# EAGLE design Filter Big 1.0 (EAGLE 7.2.0)
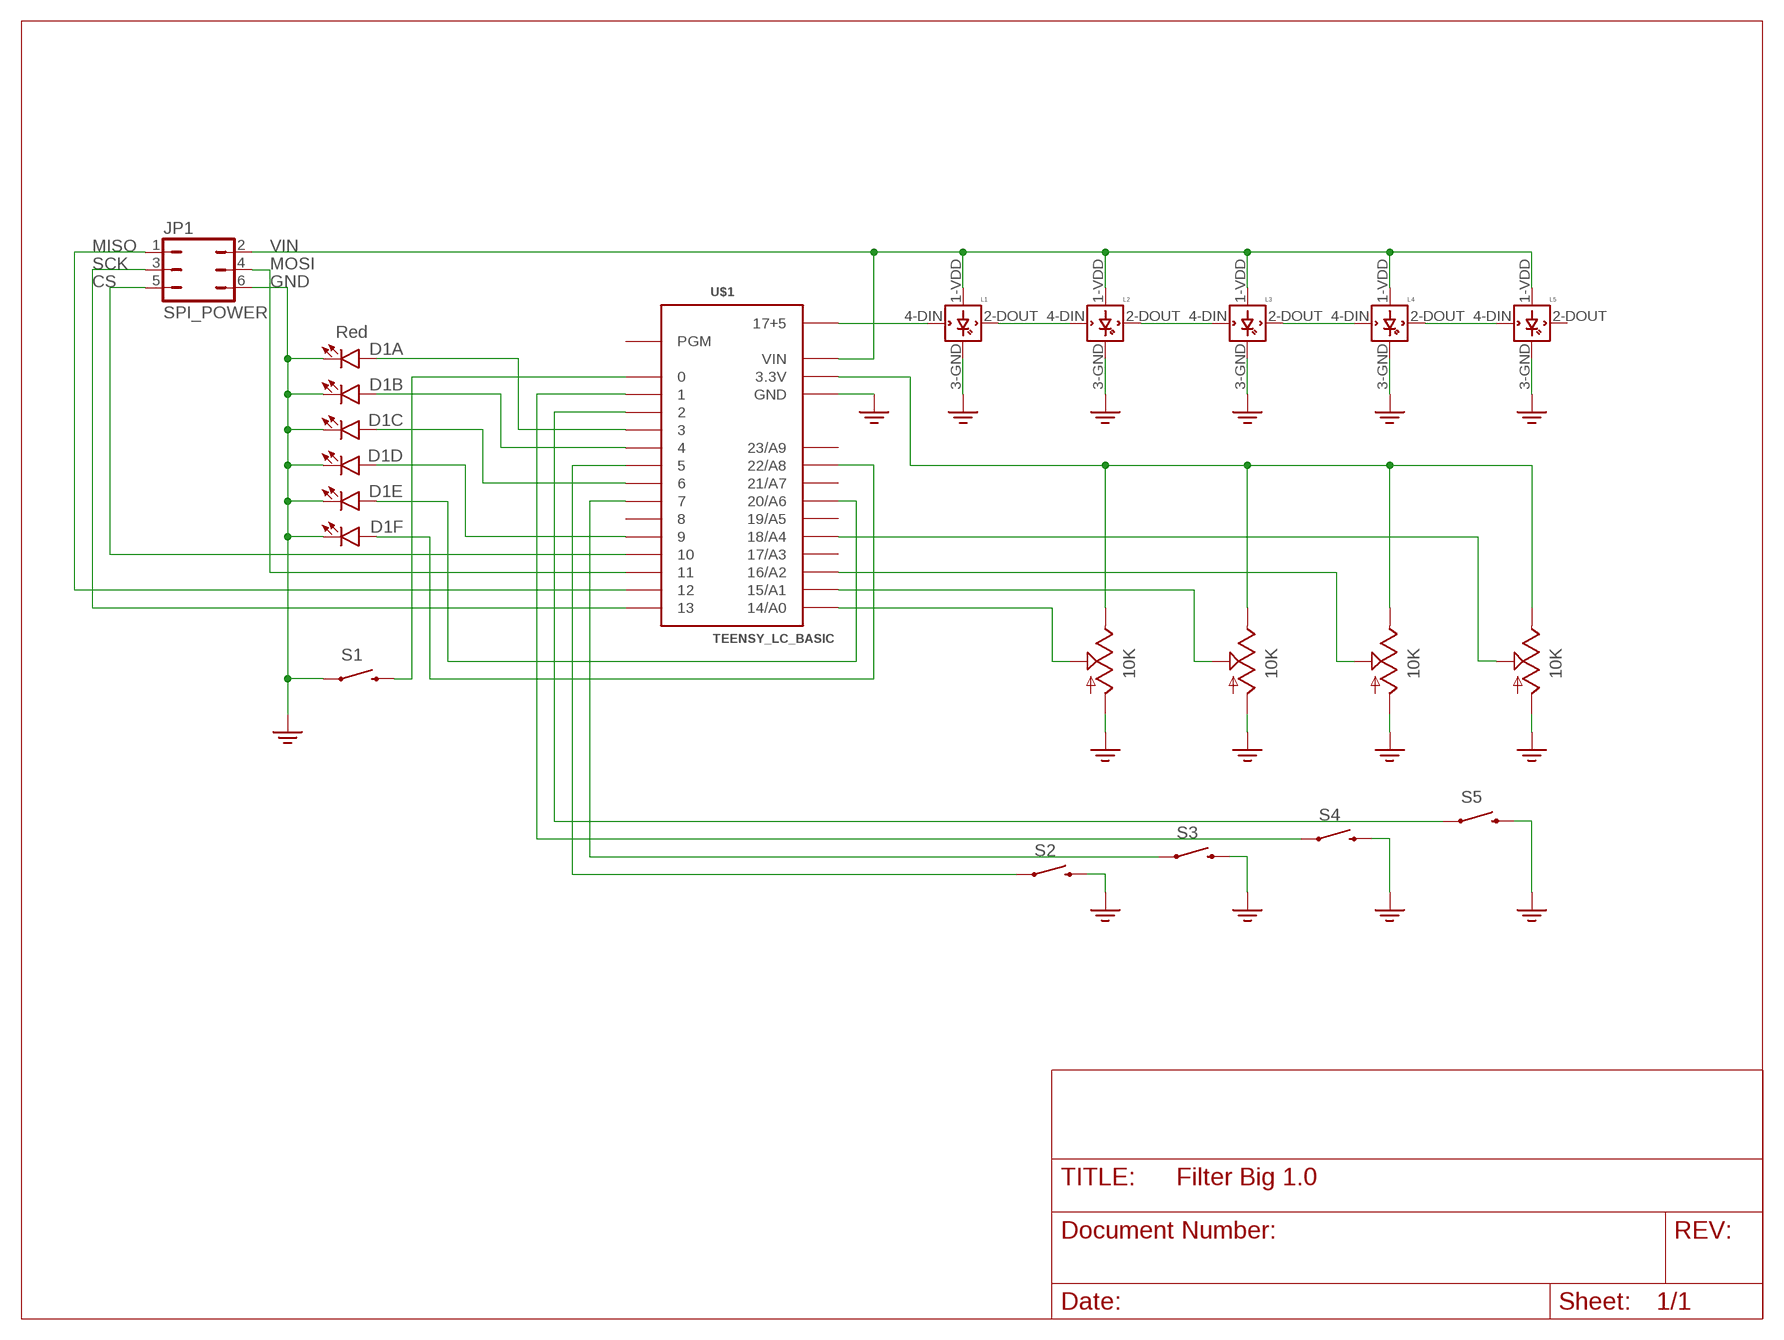
[diagram p0: schematic, sheet 1]

## Parts
D1  Red  LED_BARGRAPH_6  [LED_BARGRAPH_6]
JP1  SPI_POWER  JP3Q  [JP3Q]
L1  WS2812B  [WS2812B]
L2  WS2812B  [WS2812B]
L3  WS2812B  [WS2812B]
L4  WS2812B  [WS2812B]
L5  WS2812B  [WS2812B]
S1  SWITCH-MOMENTARY-212MM  [TACTILE-PTH-12MM]
S2  SWITCH-MOMENTARY-2SMD  [TACTILE-SWITCH-SMD]
S3  SWITCH-MOMENTARY-2SMD  [TACTILE-SWITCH-SMD]
S4  SWITCH-MOMENTARY-2SMD  [TACTILE-SWITCH-SMD]
S5  SWITCH-MOMENTARY-2SMD  [TACTILE-SWITCH-SMD]
U$1  TEENSY_LC_BASIC  [TEENSY_LC_BASIC]
U$2  10K  ALPHA1400F10K  [14MMPOT]
U$3  10K  ALPHA1400F10K  [14MMPOT]
U$4  10K  ALPHA1400F10K  [14MMPOT]
U$5  10K  ALPHA1400F10K  [14MMPOT]

## Nets
3.3V: U$1.3.3V1(3.3V) U$2.P$4(E) U$3.P$4(E) U$4.P$4(E) U$5.P$4(E)
GND: D1.7(F:C) D1.8(E:C) D1.9(D:C) D1.10(C:C) D1.11(B:C) D1.12(A:C) JP1.6 L1.3-GND(GND) L2.3-GND(GND) L3.3-GND(GND) L4.3-GND(GND) L5.3-GND(GND) S1.1 S2.3 S3.3 S4.3 S5.3 U$1.GND U$1.GND1(GND) U$1.GND2(GND) U$2.P$5(A) U$3.P$5(A) U$4.P$5(A) U$5.P$5(A) ; supply symbol labelled GND2
N$1: L1.4-DIN(DIN) U$1.17+5
N$2: L1.2-DOUT(DOUT) L2.4-DIN(DIN)
N$3: L2.2-DOUT(DOUT) L3.4-DIN(DIN)
N$4: L3.2-DOUT(DOUT) L4.4-DIN(DIN)
N$5: L4.2-DOUT(DOUT) L5.4-DIN(DIN)
N$7: U$1.14/A0 U$2.P$3(S)
N$8: U$1.15/A1 U$3.P$3(S)
N$9: U$1.16/A2 U$4.P$3(S)
N$10: U$1.18/A4 U$5.P$3(S)
N$12: S2.1 U$1.5
N$13: S3.1 U$1.7
N$14: S4.1 U$1.1
N$15: D1.1(A:A) U$1.3
N$16: D1.2(B:A) U$1.4
N$17: D1.3(C:A) U$1.6
N$18: D1.4(D:A) U$1.9
N$19: D1.5(E:A) U$1.20/A6
N$20: D1.6(F:A) U$1.22/A8
N$21: JP1.1 U$1.12
N$22: S1.3 U$1.0
N$23: JP1.3 U$1.13
N$24: JP1.5 U$1.10
N$25: S5.1 U$1.2
N$28: JP1.4 U$1.11
VIN: JP1.2 L1.1-VDD(VDD) L2.1-VDD(VDD) L3.1-VDD(VDD) L4.1-VDD(VDD) L5.1-VDD(VDD) U$1.VIN
Unconnected: L5.2-DOUT(DOUT) U$1.8 U$1.17/A3 U$1.19/A5 U$1.21/A7 U$1.23/A9 U$1.PGM

## Notes on the sheet
- MISO | VIN
- SCK | MOSI
- CS | GND

## Library data of the parts
D1 = SynthLib:LED_BARGRAPH_6: 10-Segment LED Bar Graph SFE part numbers: COM-09935 (red, Vf = 2.1V, Ifmax = 20mA) COM-09936 (yellow, Vf = 2.1V, Ifmax = 20mA) COM-09937 (blue, Vf = 3.4V, Ifmax = 20mA) COM-09938 (green, Vf = 3.4V, Ifmax = 20mA)
JP1 = jumper:JP3Q: JUMPER
L1-L5 = SynthLib:WS2812B
S1 = SynthLib:SWITCH-MOMENTARY-2: Various NO switches- pushbuttons, reed, etc; PROD_ID: SWCH-09185
S2-S5 = SynthLib:SWITCH-MOMENTARY-2: Various NO switches- pushbuttons, reed, etc; PROD_ID: SWCH-08247
U$1 = SynthLib:TEENSY_LC_BASIC: Basic Teensy LC with none of the 'inner' pins enabled. See '+4', 'AllAnalogPins", and 'AllPins' packages for additional pin holes, as needed.
U$2-U$5 = SynthLib:ALPHA1400F: Alpha 1400F series clear shaft potentiometer

## Board
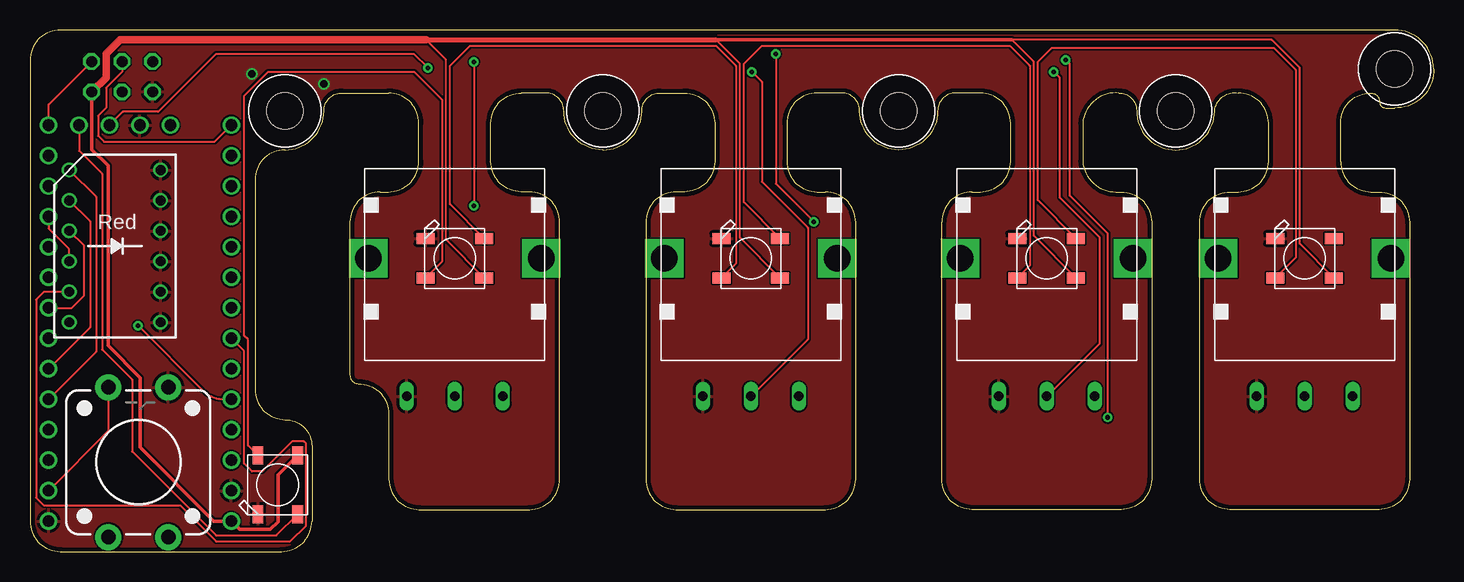
[diagram p1: board, top side]
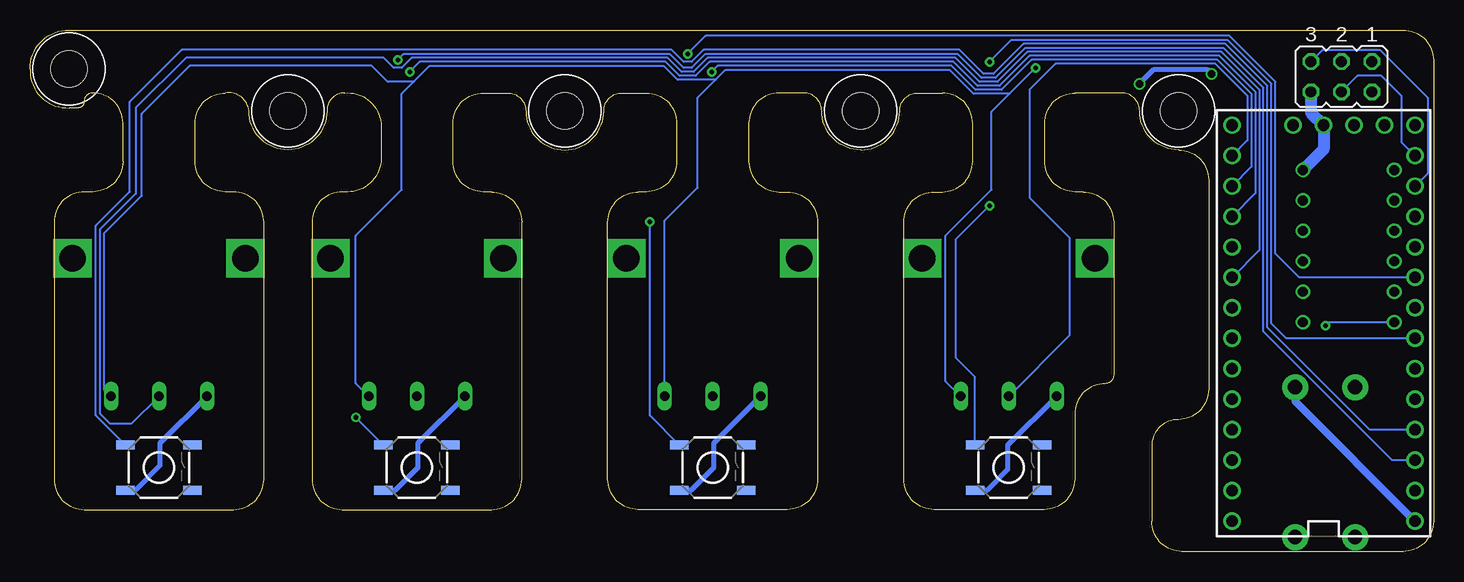
[diagram p2: board, bottom side, seen from below]

Size 117 x 43.5 mm. Coordinates in mm from the lower left corner, seen from the top.
Outline: 29.92,9.46 29.92,6.04 arc90 32.46,3.5 41.63,3.5 arc90 44.17,6.04 44.17,27.46 arc90 41.63,30
Outline: 78.54,30 arc90 76,27.46 76,6.04 arc90 78.54,3.5 90.96,3.5 arc90 93.5,6.04 93.5,27.46 arc90 90.96,30 90.79,30 arc-90 87.75,32.54 87.75,35.71 arc-90 90.79,38.25 arc-90 92.25,36.79 92.25,36.75 arc90 95.5,33.5 arc90 98.75,36.75 98.75,36.79 arc-90 100.71,38.25 arc-90 103.25,35.71 103.25,32.54 arc-90 100.71,30 100.04,30 arc90 97.5,27.46 97.5,6.04 arc90 100.04,3.5 112.46,3.5 arc90 115,6.04 115,27.46 arc90 112.46,30 111.79,30 arc-90 109.25,32.54 109.25,35.71
Outline: 109.25,35.75 arc-90 111.75,38.25 arc-90 112.5,37.5 arc90 113,37 113.75,37 arc90 117,40 117,40.25 arc90 113.75,43.5 2.54,43.5 arc90 0,40.96 0,2.54 arc90 2.54,0 20.96,0 arc90 23.5,2.54 23.5,8.79 arc90 21.29,11 arc-90 18.75,13.54 18.75,31 arc-90 21.25,33.5 arc90 24.5,36.75 arc-90 26,38.25 29.88,38.25 arc-90 32.42,35.71 32.42,32.54 arc-90 29.88,30 29.21,30 arc90 26.67,27.46 26.67,14.71 arc90 27.38,14 arc-90 29.92,11.46 29.92,9.5
Outline: 41.75,30 40.96,30 arc-90 38.42,32.54 38.42,35.71 arc-90 40.96,38.25 43,38.25 arc-90 44.5,36.75 arc90 47.75,33.5 arc90 51,36.75 arc-90 52.5,38.25 54.54,38.25 arc-90 57.08,35.71 57.08,32.54 arc-90 54.54,30 53.87,30 arc90 51.33,27.46 51.33,6.04 arc90 53.87,3.5 66.29,3.5 arc90 68.83,6.04 68.83,27.46 arc90 66.29,30 65.62,30 arc-90 63.08,32.54 63.08,35.71 arc-90 65.62,38.25 67.67,38.25 arc-90 69.17,36.75 arc90 72.42,33.5 arc90 75.67,36.75 arc-90 77.17,38.25 79.21,38.25 arc-90 81.75,35.71 81.75,32.54 arc-90 79.21,30 78.5,30
Copper layers (1*16): Top 0.0356mm / dielectric 1.5011mm / Bottom 0.0356mm
Design rules "LaenPCBOrder *": minimum track width 6mil, minimum drill 13mil, track to track 6mil, track to pad 6mil, pad to pad 6mil, via to via 6mil, smd to smd 6mil, copper to edge 15mil, drill to drill 6mil, minimum pad ring 7mil, minimum via ring 7mil, stop-mask expansion 3mil, vias tented up to drill 0mil, thermal gap 10mil

### Footprints (pad centres in the part's own frame; a part is rotated, then mirrored left to right if it is on the bottom)
LED_BARGRAPH_6 = drill 0.813: 1 -6.35,-3.81; 2 -3.81,-3.81; 3 -1.27,-3.81; 4 1.27,-3.81; 5 3.81,-3.81; 6 6.35,-3.81; 7 6.35,3.81; 8 3.81,3.81; 9 1.27,3.81; 10 -1.27,3.81; 11 -3.81,3.81; 12 -6.35,3.81
JP3Q = drill 0.914 octagon: 1 -2.54,-1.27; 2 -2.54,1.27; 3 0,-1.27; 4 0,1.27; 5 2.54,-1.27; 6 2.54,1.27
WS2812B = smd 1.5 x 0.9: 1-VDD 2.45,-1.65; 2-DOUT 2.45,1.65; 3-GND -2.45,1.65; 4-DIN -2.45,-1.65
TACTILE-PTH-12MM = drill 1.2 pad 2.159: 1 6.25,-2.5; 2 -6.25,-2.5; 3 6.25,2.5; 4 -6.25,2.5
TACTILE-SWITCH-SMD = smd 1.524 x 0.762: 1 -2.794,1.905; 2 2.794,1.905; 3 -2.794,-1.905; 4 2.794,-1.905
TEENSY_LC_BASIC = drill 0.965: 0 -7.62,13.97; 1 -7.62,11.43; 2 -7.62,8.89; 3 -7.62,6.35; 3.3V 7.62,11.43; 3.3V1 -2.54,-16.51; 4 -7.62,3.81; 5 -7.62,1.27; 6 -7.62,-1.27; 7 -7.62,-3.81; 8 -7.62,-6.35; 9 -7.62,-8.89; 10 -7.62,-11.43; 11 -7.62,-13.97; 12 -7.62,-16.51; 13 7.62,-16.51; 14/A0 7.62,-13.97; 15/A1 7.62,-11.43; 16/A2 7.62,-8.89; 17+5 -5.08,-16.51; 17/A3 7.62,-6.35; 18/A4 7.62,-3.81; 19/A5 7.62,-1.27; 20/A6 7.62,1.27; 21/A7 7.62,3.81; 22/A8 7.62,6.35; 23/A9 7.62,8.89; GND -7.62,16.51; GND1 0,-16.51; GND2 7.62,13.97; PGM 2.54,-16.51; VIN 7.62,16.51
14MMPOT = drill 2.2 square: P$1 -7.2,0; P$2 7.2,0 | drill 0.8 long: P$3 0,-11.5; P$4 4,-11.5; P$5 -4,-11.5
STANDOFF-M3 = hole 3: 0,0

### Placement (x,y rotation side)
D1  7.08,25.47 270 top
JP1  7.67,39.6 180 bottom
L1  20.65,5.56 90 top
L2  35.42,24.45 0 top
L3  60.08,24.45 0 top
L4  84.75,24.45 0 top
L5  106.25,24.45 0 top
S1  9.04,7.45 90 top
S2  35.42,7 0 bottom
S3  60.08,7 0 bottom
S4  84.75,7 0 bottom
S5  106.25,7 0 bottom
U$1  9.16,19.05 180 bottom
U$2  35.42,24.45 0 top
U$3  60.08,24.45 0 top
U$4  84.75,24.45 0 top
U$5  106.25,24.45 0 top
U$6  [STANDOFF-M3]  21.25,36.75 0 top
U$7  [STANDOFF-M3]  47.75,36.75 0 top
U$8  [STANDOFF-M3]  72.42,36.75 0 top
U$9  [STANDOFF-M3]  95.5,36.75 0 top
U$10  [STANDOFF-M3]  113.75,40.25 0 top

### Tracks (layer width: path | path; a pad name or v marks a point on that pad's centre or on a via)
3.3V  (via drill 0.4)
  Top 0.16: 14.33,40.33 10.67,36.67 7.73,36.67 U$1.3.3V1 | 14.33,40.33 | 14.33,40.33 15.5,41.5 32,41.5 v33.17,40.33
  Bottom 0.16: U$2.P$4 40.67,14.2 40.67,26.33 36.83,30.17 36.83,36.67 35.33,38.17 | U$4.P$4 89.83,14.03 89.83,26.33 86,30.17 86,38.17 85,39.17 | U$5.P$4 110.83,13.53 110.83,26.5 107.67,29.67 107.67,36.5 103.67,40.5 88.5,40.5 87.17,39.17 85,39.17 | U$3.P$4 64.08,27.58 61.33,30.33 61.33,37.83 59.83,39.33 | 59.83,39.33 59,40.17 40.33,40.17 38.33,38.17 35.33,38.17 | 59.83,39.33 63,39.33 64.17,40.5 83.67,40.5 85,39.17 | v33.17,40.33 | v33.17,40.33 35.33,38.17
GND  (via drill 0.6)
  Bottom 0.406: U$2.P$5 35.5,8.87 35.5,6.83 37.24,5.09 S2.3 | U$3.P$5 60,9.03 60,7 61.91,5.09 S3.3 | U$4.P$5 84.67,9.03 84.67,7 86.57,5.09 S4.3 | U$5.P$5 106.17,9.03 106.17,7.17 108.24,5.09 S5.3 | v18.5,39.83 18.83,40.17 23.33,40.17 v24.5,39
  Bottom 0.61: S1.1 11.54,12.53 U$1.GND
  Bottom 1.016: JP1.6 10.21,36.61 U$1.GND1 9.16,33.55 D1.12
  pour Top: 121.5,44.5 121.5,-1 -1,-1 -1,44.5
N$1
  Top 0.16: L1.4-DIN 20.52,1.33 15.5,1.33 8.5,8.33 8.5,14.33 6,16.83 6,31.5 4.08,33.42 U$1.17+5
N$2
  Top 0.16: L2.4-DIN 34.33,24.17 34.33,37.67 32,40 19.83,40 17.83,38 17.83,18 18.17,17.67 18.17,8.84 L1.2-DOUT
N$3
  Top 0.16: L2.2-DOUT 35,28.97 35,40.5 36.67,42.17 57.17,42.17 58.83,40.5 58.83,24 L3.4-DIN
N$4
  Top 0.16: L3.2-DOUT 59.5,29.13 59.5,40.67 61,42.17 81.67,42.17 83.33,40.5 83.33,23.83 L4.4-DIN
N$5
  Top 0.16: L4.2-DOUT 84,29.3 84,40.83 85.17,42 103.67,42 105.5,40.17 105.5,24.5 L5.4-DIN
N$7
  Bottom 0.16: U$2.P$3 30.33,18.03 30.33,26.17 33.67,29.5 33.67,38.5 31.5,40.67 18.17,40.67 15.5,38 15.5,34.3 U$1.14/A0
N$8  (via drill 0.4)
  Top 0.16: v60.17,40 61,39.17 61,30.83 64.83,27 64.83,17.7 U$3.P$3
  Bottom 0.16: U$1.15/A1 15.17,32.1 15.17,38.17 18,41 33.5,41 36,38.5 38.17,38.5 40.17,40.5 59.67,40.5 v60.17,40
N$9  (via drill 0.4)
  Top 0.16: U$4.P$3 89.17,17.37 89.17,26.17 85.83,29.5 85.83,39.5 v85.33,40
  Bottom 0.16: U$1.16/A2 14.83,29.89 14.83,38.33 17.83,41.33 33.67,41.33 36.17,38.83 38,38.83 40,40.83 60.33,40.83 61.5,39.67 62.83,39.67 64,40.83 84.5,40.83 v85.33,40
N$10
  Bottom 0.16: U$5.P$3 108.53,10.67 110.33,10.67 111.17,11.5 111.17,26.83 108.17,29.83 108.17,37 104,41.17 87.5,41.17 86.67,40.33 86,40.33 85.17,41.17 63.83,41.17 62.67,40 61.67,40 60.5,41.17 39.83,41.17 37.83,39.17 36.33,39.17 33.83,41.67 17.67,41.67 14.5,38.5 14.5,25.14 U$1.18/A4
N$12  (via drill 0.4)
  Top 0.16: v37,40.83 v37,28.83
  Bottom 0.16: U$1.5 12.28,17.78 13.5,19 13.5,39 17.17,42.67 35.17,42.67 v37,40.83 | v37,28.83 39.83,26 39.83,16.17 38.21,14.54 S2.1
N$13  (via drill 0.4)
  Top 0.16: v65.33,27.5 62.17,30.67 v62.17,41.5
  Bottom 0.16: U$1.7 11.19,22.86 13.17,24.83 13.17,39.17 17,43 60.67,43 v62.17,41.5 | v65.33,27.5 65.33,11.33 65.31,11.33 S3.1
N$14  (via drill 0.4)
  Top 0.16: v89.83,11.19 89.83,26.5 86.67,29.67 86.67,40.67 v86.33,41
  Bottom 0.16: U$1.1 3.45,7.62 14.17,18.33 14.17,38.67 17.5,42 34,42 36.5,39.5 37.67,39.5 39.67,41.5 60.67,41.5 61.83,40.33 62.5,40.33 63.67,41.5 85.83,41.5 v86.33,41 | S4.1 v89.83,11.19
N$15
  Top 0.16: D1.1 5.5,29.59 5.5,16.66 U$1.3
N$16
  Top 0.16: D1.2 5,27.55 5,18.7 U$1.4
N$17
  Top 0.16: U$1.6 3.49,20.32 4.5,21.33 4.5,25.51 D1.3
N$18
  Top 0.16: D1.4 3.27,25.23 1.54,26.96 U$1.9
N$19
  Top 0.16: D1.5 1.16,21.66 0.5,21 0.5,4.5 1.17,3.83 12.5,3.83 15.5,0.83 21.67,0.83 23,2.17 23,9 22.83,9.17 21.83,9.17 19.33,6.67 18.5,6.67 17.83,7.33 17.83,16.73 U$1.20/A6
N$20  (via drill 0.4)
  Top 0.16: v9,18.83 14.39,13.44 arc45 16.18,12.7 U$1.22/A8
  Bottom 0.16: D1.6 8.71,19.12 v9,18.83
N$21
  Top 0.16: U$1.12 1.54,37.29 JP1.1
N$22
  Top 0.16: S1.3 6.54,10.07 U$1.0
N$23
  Top 0.16: JP1.3 7.67,40 6.33,38.67 6.33,37 5.67,36.33 5.67,34.67 6.17,34.17 15.39,34.17 U$1.13
N$24
  Bottom 0.16: JP1.5 9.25,41.83 4.5,41.83 0.5,37.83 0.5,31.52 U$1.10
N$25
  Bottom 0.16: U$1.2 5.33,10.16 13.83,18.67 13.83,38.83 17.33,42.33 34.17,42.33 36.67,39.83 37.5,39.83 39.5,41.83 60.83,41.83 61.83,40.83 62.5,40.83 63.5,41.83 104.33,41.83 108.67,37.5 108.67,30 111.5,27.17 111.5,11.36 S5.1
N$28
  Bottom 0.16: JP1.4 6.34,39.67 4.33,39.67 2.67,38 2.67,34.14 U$1.11
VIN
  Top 0.16: L2.1-VDD 34.67,26 34.67,41 33,42.67 | L3.1-VDD 59.17,26.17 59.17,40.67 57.17,42.67 | L4.1-VDD 83.67,26.33 83.67,40.83 81.83,42.67 103.5,42.67 105.83,40.33 105.83,25.67 L5.1-VDD
  Top 0.305: 57.17,42.67 81.83,42.67 | JP1.2 5.13,33.54 6.5,32.17 6.5,17.17 9.17,14.5 9.17,8.67 15.29,2.54 U$1.VIN 17.49,1.83 20,1.83 20.67,2.5 20.67,6.38 L1.1-VDD
  Top 0.406: 33,42.67 57.17,42.67
  Top 0.61: JP1.2 6.33,39.54 6.33,41.5 7.5,42.67 33,42.67